# EAGLE schematic LCD LED (EAGLE 6.5.0)

## Sheet 1 of 2
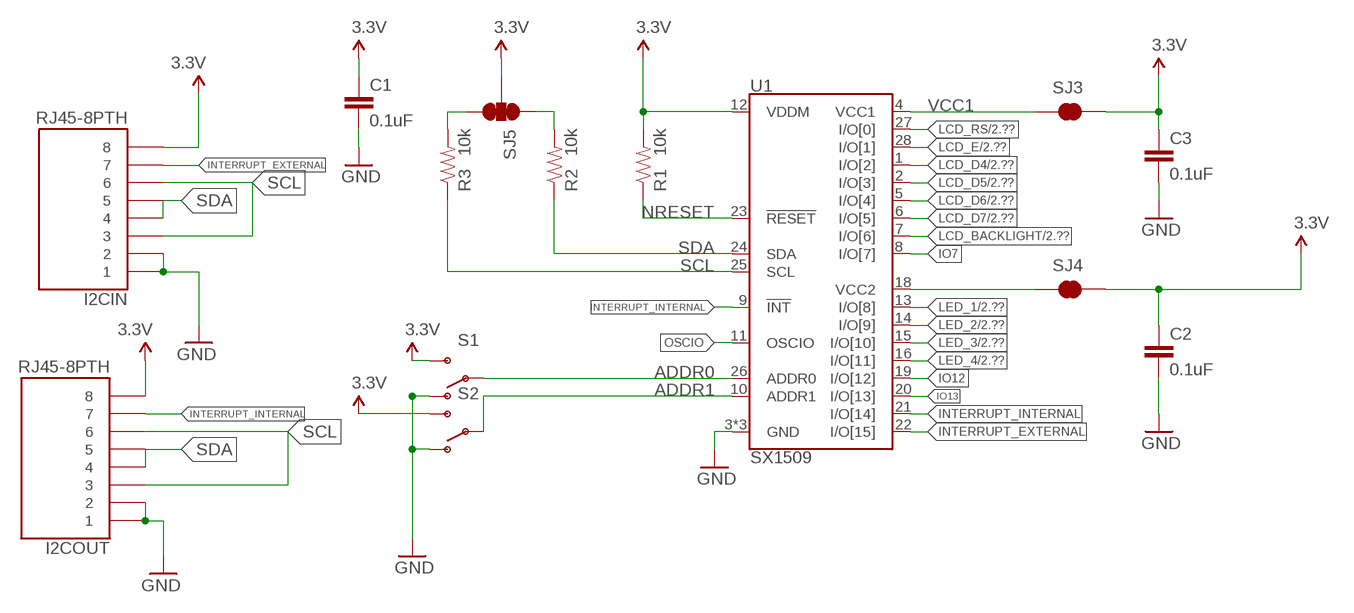
[diagram p0: schematic, sheet 1]

### Parts
C1  0.1uF  CAP0402-CAP  [0402-CAP]
C2  0.1uF  CAP0402-CAP  [0402-CAP]
C3  0.1uF  CAP0402-CAP  [0402-CAP]
I2CIN  RJ45-8PTH  [RJ45-8]
I2COUT  RJ45-8PTH  [RJ45-8]
R1  10k  RESISTOR0402-RES  [0402-RES]
R2  10k  RESISTOR0402-RES  [0402-RES]
R3  10k  RESISTOR0402-RES  [0402-RES]
S1  SWITCH-SPDT-SMD-A  [SWITCH-SPST-SMD-A]
S2  SWITCH-SPDT-SMD-A  [SWITCH-SPST-SMD-A]
SJ3  SOLDERJUMPERNO  [SJ_2S-NO]
SJ4  SOLDERJUMPERNO  [SJ_2S-NO]
SJ5  SOLDERJUMPER_2WAYS  [SJ_3]
U1  SX1509  [QFN-28]

### Nets
3.3V: C1.1 C2.1 C3.1 I2CIN.8 I2COUT.8 R1.2 S1.3(S) S2.3(S) SJ3.2 SJ4.2 SJ5.2 U1.12(VDDM) ; also sheet 2
ADDR0: S1.2(P) U1.26(ADDR0)
ADDR1: S2.2(P) U1.10(ADDR1)
GND: C1.2 C2.2 C3.2 I2CIN.1 I2CIN.2 I2COUT.1 I2COUT.2 S1.1(O) S2.1(O) U1.3(GND) U1.17(GND) U1.29(GND) ; also sheet 2
INTERRUPT_EXTERNAL: I2CIN.7 U1.22(I/O[15])
INTERRUPT_INTERNAL: I2COUT.7 U1.9(!INT) U1.21(I/O[14])
IO7: U1.8(I/O[7])
IO12: U1.19(I/O[12])
IO13: U1.20(I/O[13])
LCD_BACKLIGHT: U1.7(I/O[6]) ; also sheet 2
LCD_D4: U1.1(I/O[2]) ; also sheet 2
LCD_D5: U1.2(I/O[3]) ; also sheet 2
LCD_D6: U1.5(I/O[4]) ; also sheet 2
LCD_D7: U1.6(I/O[5]) ; also sheet 2
LCD_E: U1.28(I/O[1]) ; also sheet 2
LCD_RS: U1.27(I/O[0]) ; also sheet 2
LED_1: U1.13(I/O[8]) ; also sheet 2
LED_2: U1.14(I/O[9]) ; also sheet 2
LED_3: U1.15(I/O[10]) ; also sheet 2
LED_4: U1.16(I/O[11]) ; also sheet 2
N$1: R3.2 SJ5.3
N$2: R2.2 SJ5.1
NRESET: R1.1 U1.23(!RESET)
OSCIO: U1.11(OSCIO)
SCL: I2CIN.3 I2CIN.6 I2COUT.3 I2COUT.6 R3.1 U1.25(SCL)
SDA: I2CIN.4 I2CIN.5 I2COUT.4 I2COUT.5 R2.1 U1.24(SDA)
VCC1: SJ3.1 U1.4(VCC1)
VCC2: SJ4.1 U1.18(VCC2)

## Sheet 2 of 2
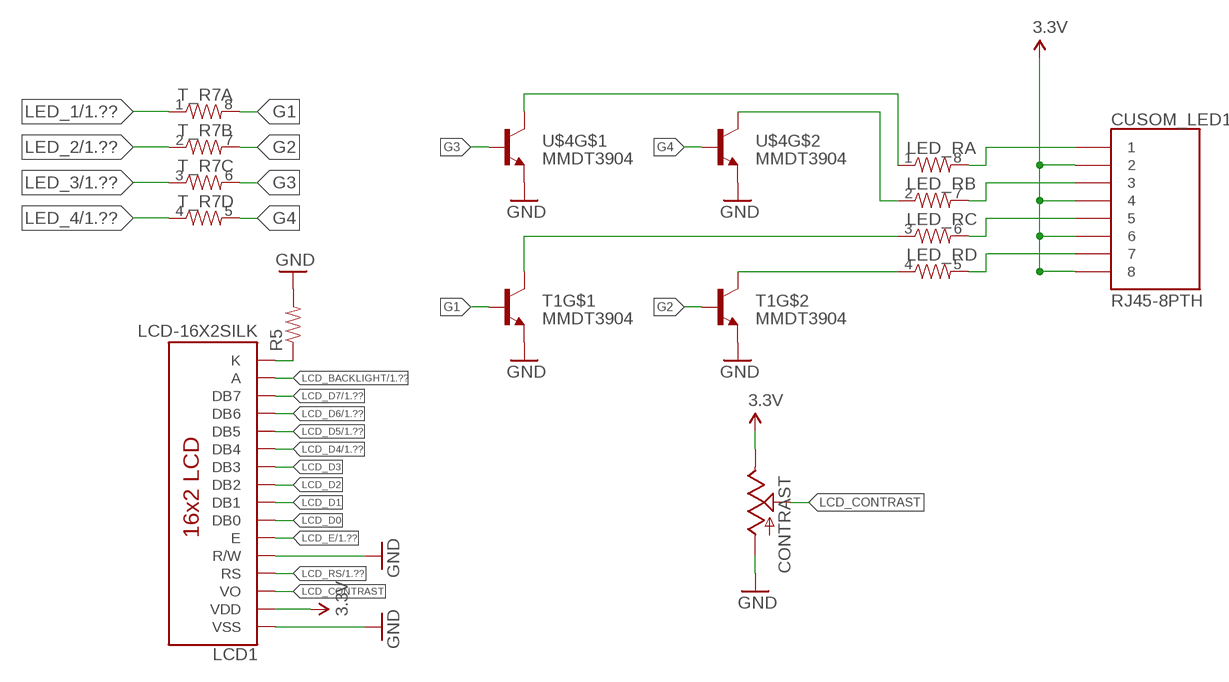
[diagram p1: schematic, sheet 2]

### Parts
CONTRAST  POT  [ALPS_POT]
CUSOM_LED1  RJ45-8PTH  [RJ45-8]
LCD1  LCD-16X2SILK  [LCD-16X2]
LED_R  RESISTOR-ARRAY0603-ARV  [0603-ARV]
R5  RESISTOR0603  [0603-RES]
T1  MMDT3904  [SOT363]
T_R7  RESISTOR-ARRAY0603-ARV  [0603-ARV]
U$4  MMDT3904  [SOT363]

### Nets
3.3V: CONTRAST.P$1(E) CUSOM_LED1.2 CUSOM_LED1.4 CUSOM_LED1.6 CUSOM_LED1.8 LCD1.2(VDD) ; also sheet 1
G1: T1.5(B) T_R7.8
G2: T1.2(B) T_R7.7
G3: T_R7.6 U$4.5(B)
G4: T_R7.5 U$4.2(B)
GND: CONTRAST.P$3(A) LCD1.1(VSS) LCD1.5(R/W) R5.2 T1.1(E) T1.4(E) U$4.1(E) U$4.4(E) ; also sheet 1
LCD_BACKLIGHT: LCD1.15(A) ; also sheet 1
LCD_CONTRAST: CONTRAST.P$2(S) LCD1.3(VO)
LCD_D0: LCD1.7(DB0)
LCD_D1: LCD1.8(DB1)
LCD_D2: LCD1.9(DB2)
LCD_D3: LCD1.10(DB3)
LCD_D4: LCD1.11(DB4) ; also sheet 1
LCD_D5: LCD1.12(DB5) ; also sheet 1
LCD_D6: LCD1.13(DB6) ; also sheet 1
LCD_D7: LCD1.14(DB7) ; also sheet 1
LCD_E: LCD1.6(E) ; also sheet 1
LCD_RS: LCD1.4(RS) ; also sheet 1
LED_1: T_R7.1 ; also sheet 1
LED_2: T_R7.2 ; also sheet 1
LED_3: T_R7.3 ; also sheet 1
LED_4: T_R7.4 ; also sheet 1
N$8: CUSOM_LED1.1 LED_R.8
N$9: LCD1.16(K) R5.1
N$10: CUSOM_LED1.3 LED_R.7
N$11: CUSOM_LED1.5 LED_R.6
N$12: CUSOM_LED1.7 LED_R.5
N$13: LED_R.1 U$4.3(C)
N$14: LED_R.2 U$4.6(C)
N$15: LED_R.3 T1.3(C)
N$16: LED_R.4 T1.6(C)

## Library data of the parts
C1-C3 = SparkFun-Passives:CAP: Capacitor Standard 0603 ceramic capacitor, and 0.1" leaded capacitor.
CONTRAST = SparkFun-Electromechanical:POT
CUSOM_LED1 I2CIN I2COUT = SparkFun-Connectors:RJ45-8: RJ45 Jack Simple RJ45, 8-pin connection - connector for common Cat5, Cat5e, and Cat6 Ethernet cables. Footprint not yet proven in production. Connector sku is PRT-00643; Breakout PCB sku is BOB-00716.
LCD1 = SparkFun-Displays:LCD-16X2: Standard text-only 16x2 parallel input LCD
LED_R T_R7 = SparkFun-Passives:RESISTOR-ARRAY: Array Chip Resistor Source: RS Component / Phycomp
R1-R3 = SparkFun-Passives:RESISTOR: Resistor Basic schematic elements and footprints for 0603, 1206, and PTH resistors.
R5 = SparkFun-Resistors:RESISTOR: Resistor Basic schematic elements and footprints for 0603, 1206, and PTH resistors.
S1 S2 = SparkFun-Electromechanical:SWITCH-SPDT: SPDT Switch Simple slide switch, Spark Fun Electronics SKU : COM-00102 DPDT SMT slide switch, AYZ0202, SWCH-08179
SJ3 SJ4 = SparkFun-Passives:SOLDERJUMPER: Solder Jumper Standard SMD solder jumper. Used to automate production. Two varients : Normally Open and Normally Closed are the same, but have different paste layers. NC will have a large amount of paste and should jumper during reflow.
SJ5 = SparkFun-Passives:SOLDERJUMPER_2WAY: Solder Jumper 2 way solder jumper
T1 U$4 = SparkFun-DiscreteSemi:MMDT3904: Dual NPN transistor
U1 = SparkFun-DigitalIC:SX1509